# Altium schematic sheet APM_OSD+.SchDoc
size A4
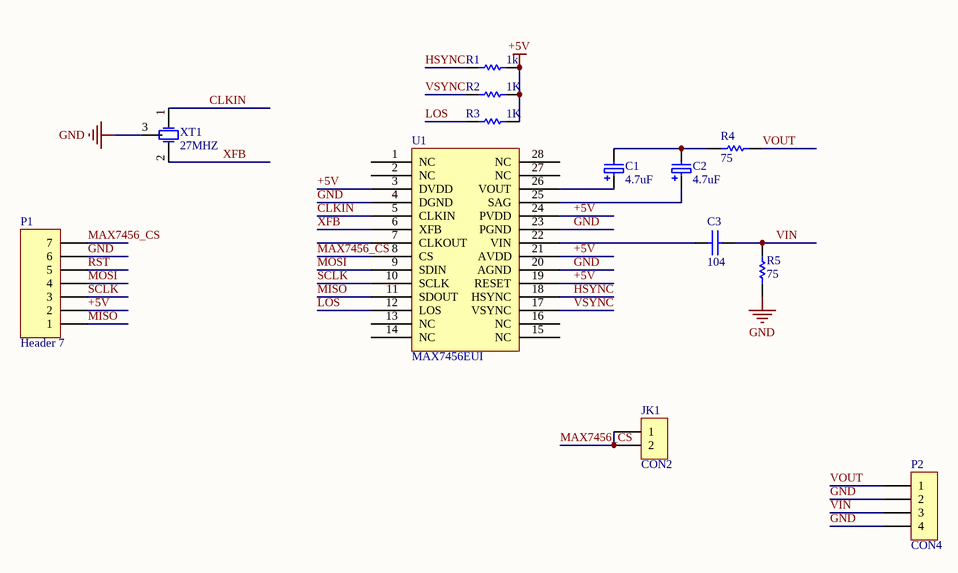
[diagram p0: APM_OSD+.SchDoc]

## Parts
C1  4.7uF  [0805C]
C2  4.7uF  [0805C]
C3  104  [0402-CAP]
JK1  CON2  [1X02-2.0]
P1  Header 7  [OSD_7P]
P2  CON4  [DF13-4P-1.25DSA]
R1  1k  [0402-RES]
R2  1K  [0402-RES]
R3  1K  [0402-RES]
R4  75  [0402-RES]
R5  75  [0402-RES]
U1  MAX7456EUI  [SSOP-28]
XT1  27MHZ  [27MHZ]

## Nets
+5V: P1.2 R1.1 R2.2 R3.2 U1.3(DVDD) U1.19(RESET) U1.21(AVDD) U1.24(PVDD)
GND: P1.6 P2.2 P2.4 R5.1 U1.4(DGND) U1.20(AGND) U1.23(PGND) XT1.3
CLKIN: U1.5(CLKIN) XT1.1
HSYNC: R1.2 U1.18(HSYNC)
LOS: R3.1 U1.12(LOS)
MAX7456_CS: JK1.1 JK1.2 P1.7 U1.8(CS)
MISO: P1.1 U1.11(SDOUT)
MOSI: P1.4 U1.9(SDIN)
RST: P1.5
SCLK: P1.3 U1.10(SCLK)
VIN: C3.2 P2.3 R5.2
VOUT: P2.1 R4.2
VSYNC: R2.1 U1.17(VSYNC)
XFB: U1.6(XFB) XT1.2
NetC1_1: C1.1 U1.26(VOUT)
NetC1_2: C1.2 C2.2 R4.1
NetC2_1: C2.1 U1.25(SAG)
NetC3_1: C3.1 U1.22(VIN)

Not connected (* = marked no-connect by the designer): U1 1(NC) 2(NC) 7(CLKOUT) 13(NC) 14(NC) 15(NC) 16(NC) 27(NC) 28(NC)

## Library data of the parts
C1 C2 = ELECTRO1: Electrolytic Capacitor 1
C3 = CAP: Capacitor
JK1 P2 = CO: Connector
P1 = Header 7: Header, 7-Pin
R1-R5 = Res1: Resistor
U1 = MAX7456
XT1 = 晶振3脚